# EAGLE board prototype_rev2 (EAGLE 6.3)
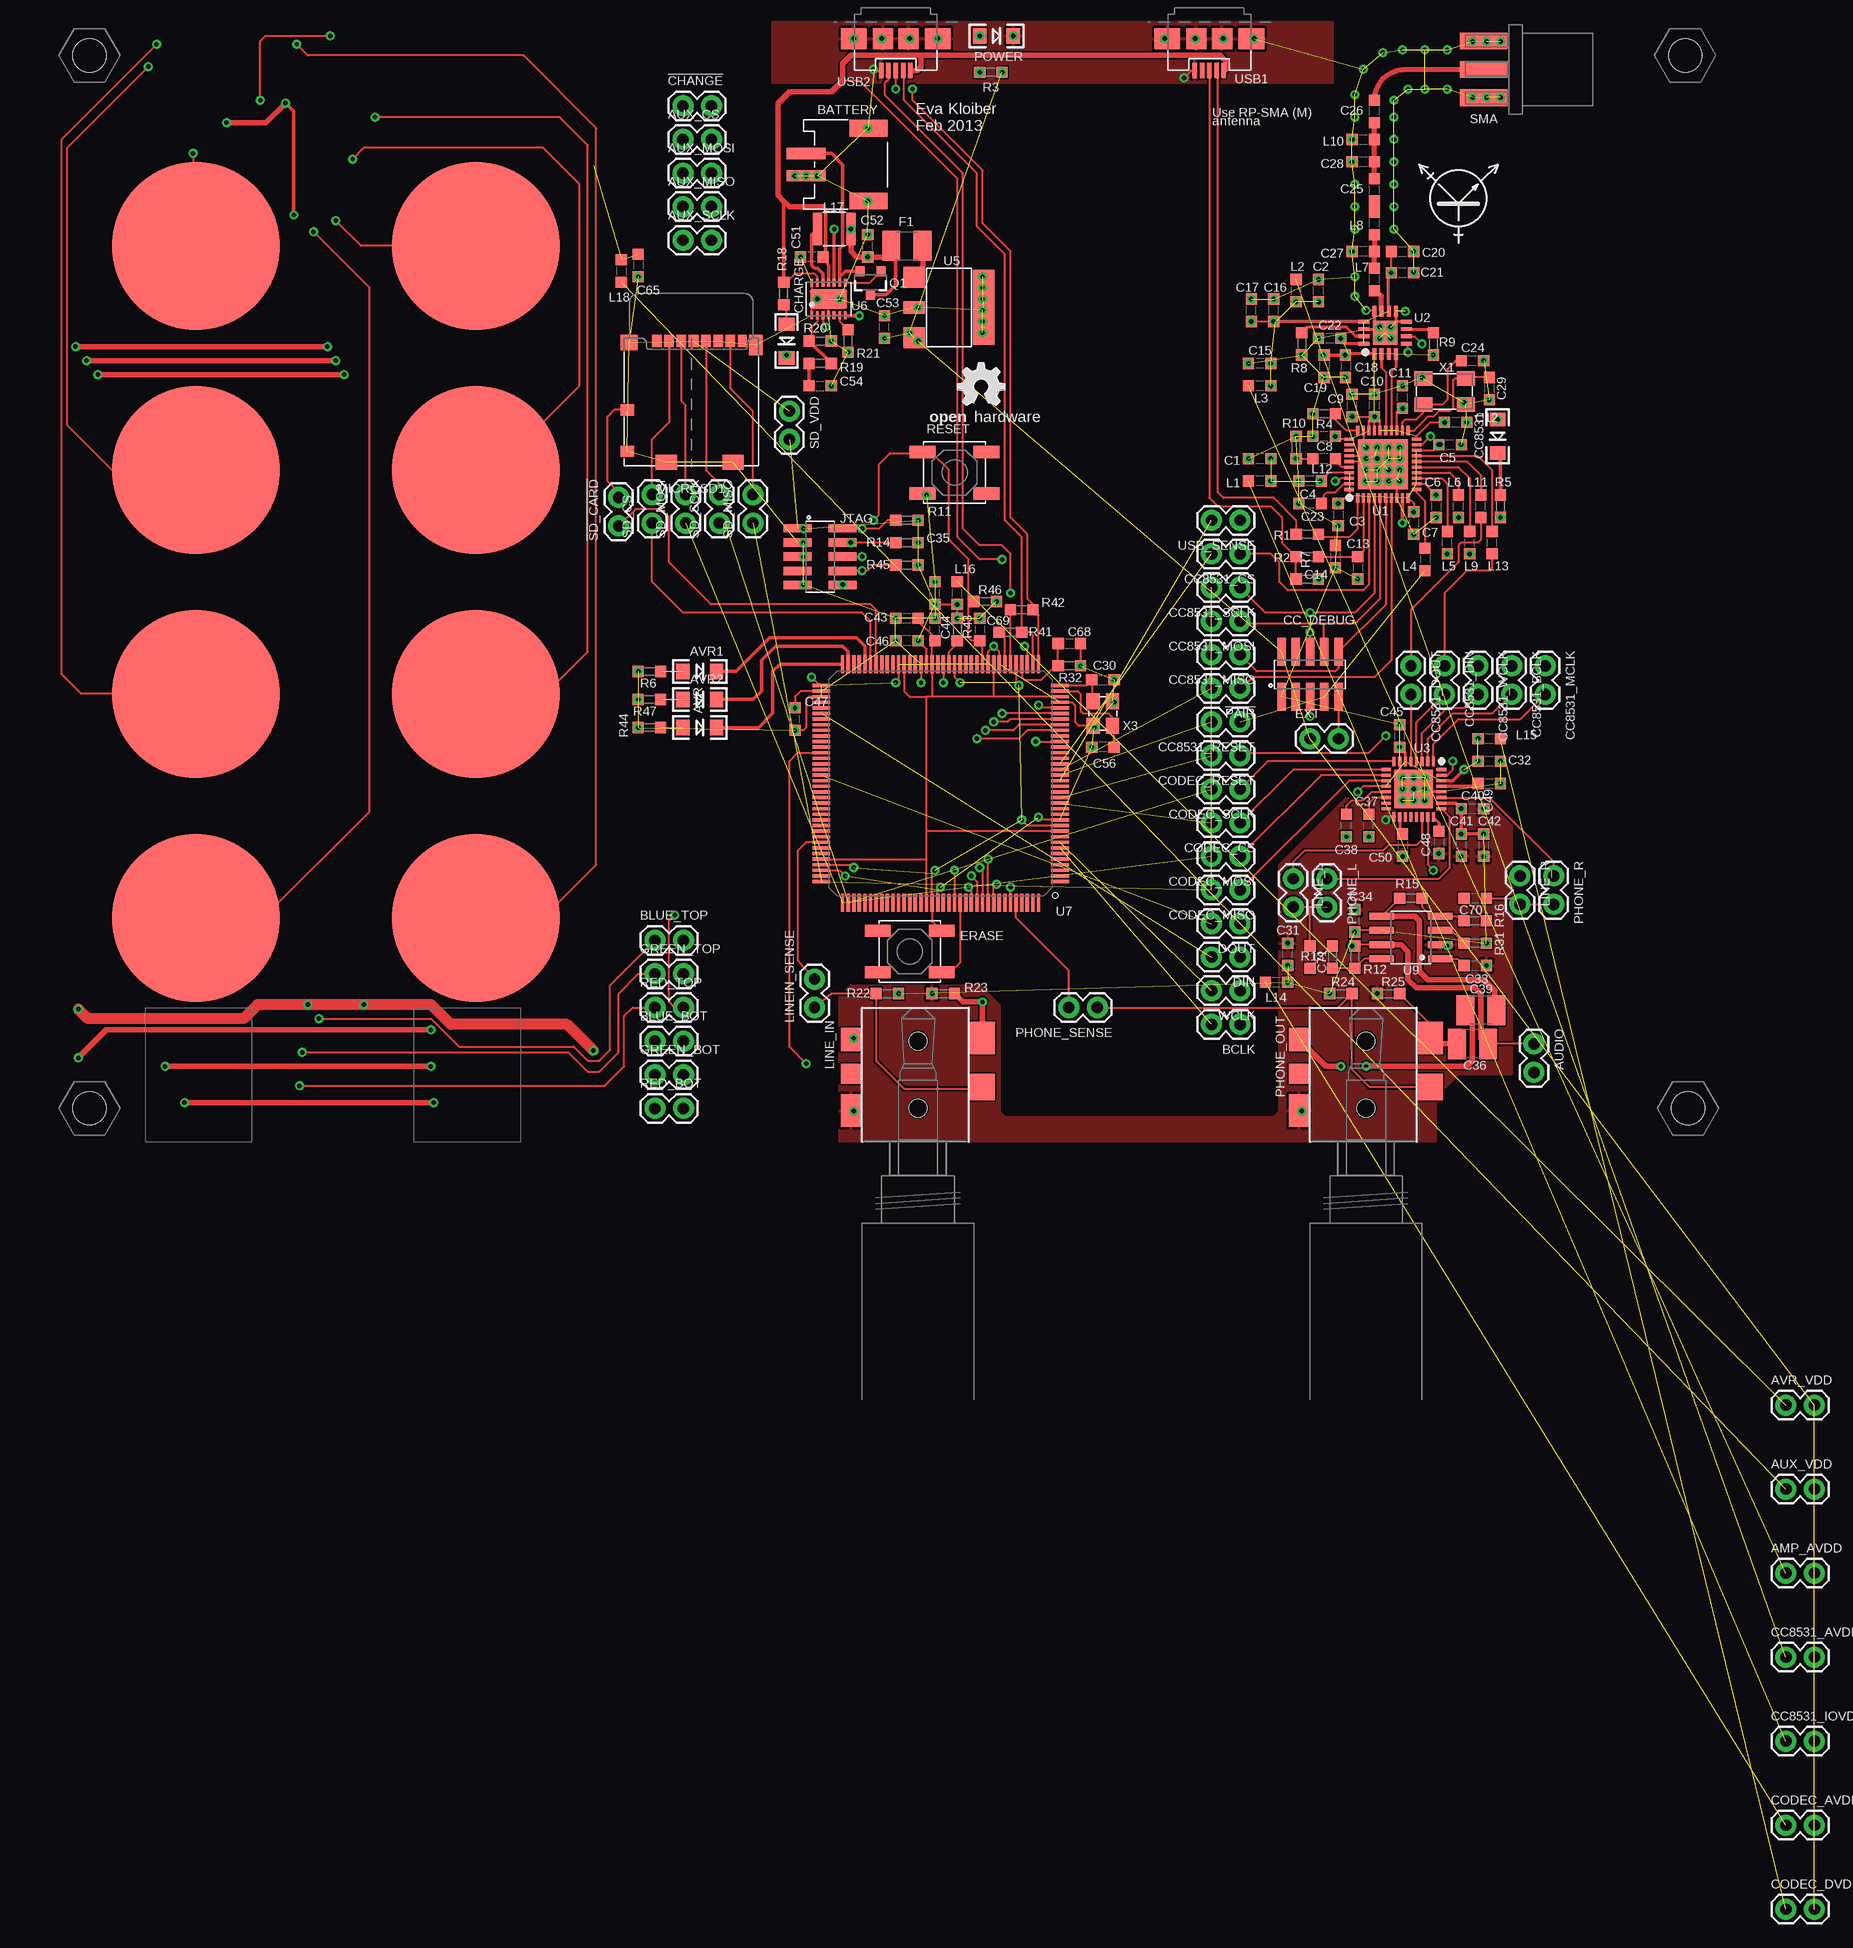
[diagram p3: board, top side]
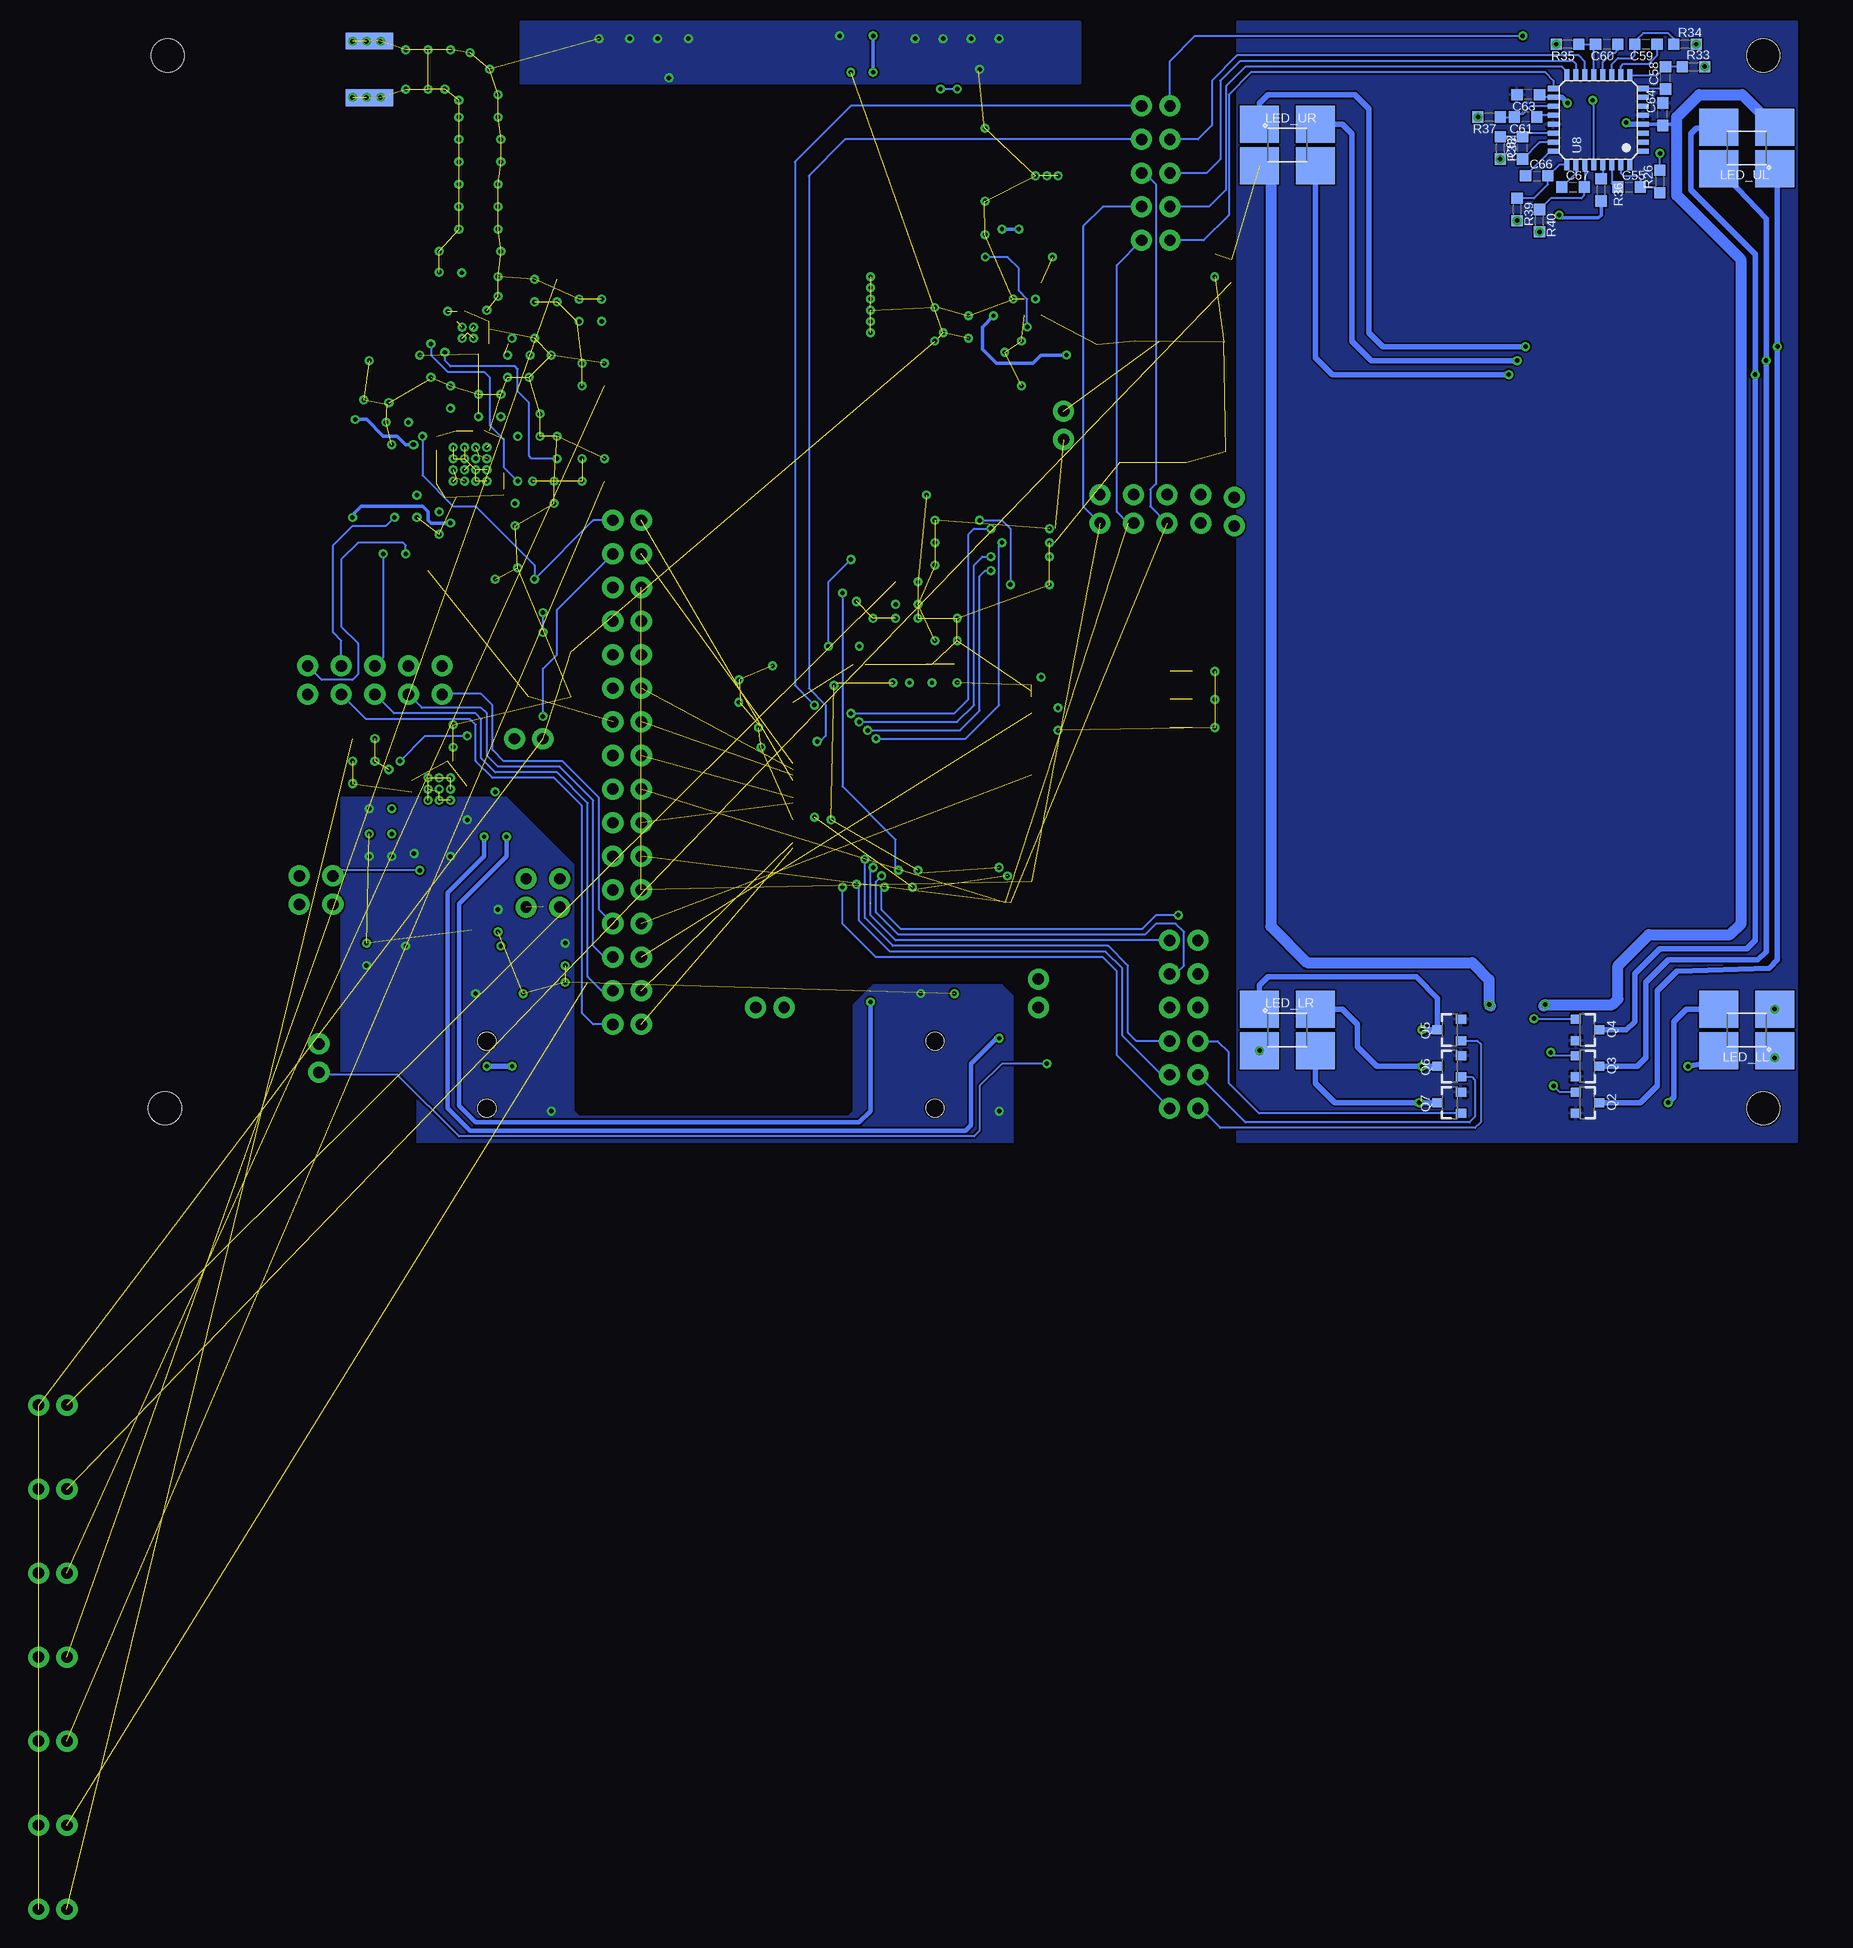
[diagram p4: board, bottom side, seen from below]

No outline drawn. Coordinates in mm, seen from the top.
Copper layers (1+2*3+16): Top 0.034290625mm / dielectric 0.24891875mm / Route2 0.034290625mm / dielectric 39mil / Route3 0.034290625mm / dielectric 0.24891875mm / Bottom 0.034290625mm
Design rules: minimum track width 6mil, minimum drill 15mil, track to track 6mil, track to pad 6mil, pad to pad 6mil, via to via 6mil, smd to smd 0mil, copper to edge 6mil, drill to drill 6mil, minimum pad ring 10mil, minimum via ring 8mil, stop-mask expansion 4mil, vias tented up to drill 0mil, thermal gap 10mil
tRestrict: area 118.8,75 to 119.5,77; area 117.5,74.8 to 118.8,75.5; area 109.2,72.8 to 116.2,73.8; area 115.5,69.8 to 117.8,70.8; area 118,63.5 to 120,70.2; area 116.8,75 to 130,96.8

## Footprints (pad centres in the part's own frame; a part is rotated, then mirrored left to right if it is on the bottom)
1X02 = drill 1.016 pad 1.88: 1 0,0; 2 2.54,0
LED-1206 = smd 1.2 x 1.4: A -1.5,0; C 1.5,0
1775469-2 = smd 1 x 3.5: + -1,-1.75; - 1,-1.75 | smd 1.5 x 3.4: X1 -3.25,3.8; X2 3.25,3.8
C0603 = smd 1 x 1: 1 -1,0; 2 1,0
C1210 = smd 1.6 x 2.7: 1 -1.4,0; 2 1.4,0
HEADER-10P-1.27MM = smd 0.75 x 2.5: 1 -2.54,-2; 2 -2.54,2; 3 -1.27,-2; 4 -1.27,2; 5 0,-2; 6 0,2; 7 1.27,-2; 8 1.27,2; 9 2.54,-2; 10 2.54,2
PTS-525 = smd 2.3 x 1.1: 1 -2.85,1.85; 2 2.85,1.85; 3 -2.85,-1.85; 4 2.85,-1.85
1210 = smd 1.6 x 2.7: 1 -1.4,0; 2 1.4,0
0603 = smd 1 x 1: 1 -1,0; 2 1,0
IFSC-1111AB-01 = smd 0.8 x 2.9: 1 -1.5,0; 2 1.5,0
PLCC-4 = smd 1.5 x 1.1: 1 -1.5,0.75; 2 -1.5,-0.75; 3 1.5,-0.75; 4 1.5,0.75 | smd 3.5 x 3.3: 1-2 -2.5,1.85; 2-2 -2.5,-1.85; 3-2 2.5,-1.85; 4-2 2.5,1.85
STX-35332-5N = smd 1.75 x 2.1: 1 -6,9.15 | smd 1.75 x 1.8: 2 -6,6.1 | smd 2.25 x 2.4: 3 5.75,4.9 | smd 2.25 x 2.9: 4 5.75,9.3 | smd 1.75 x 2.9: 5 -6,2.8 | hole 1.6: 0,9; 0,3
MOLEX_104031-0811 = smd 0.85 x 1.1: CD/DAT3 2.005,0.25; CLK -1.295,0.25; CMD 0.905,0.25; DAT0 -3.495,0.25; DAT2 3.105,0.25; VDD -0.195,0.25; VSS -2.395,0.25 | smd 0.75 x 1.1: DAT1 -4.545,0.25 | smd 1.55 x 1.35: GND1 5.565,0.375 | smd 1.17 x 1.8: GND2 -5.755,0.6 | smd 1.9 x 1.35: GND3 -3.73,11.075; GND4 2.24,11.075 | smd 1.2 x 1: SWA 5.74,6.4; SWB 5.74,10.1
SOT23-3 = smd 0.8 x 0.9: 1 -0.95,-1; 2 0.95,-1; 3 0,1.1
R0603 = smd 1 x 1: 1 -1,0; 2 1,0
CONREVSMA003.062 = smd 4.25 x 1.5 bottom: GND1 2.25,-2.54; GND3 2.25,2.54 | smd 4.25 x 1.5: GND2 2.25,-2.54; GND4 2.25,2.54; SIG 2.25,0
TOUCH-CIRCLE-15MM = smd 15 x 15: P$1 0,0
S-PVQFN-N40 = smd 0.85 x 0.28: 1 -3,2.25; 2 -3,1.75; 3 -3,1.25; 4 -3,0.75; 5 -3,0.25; 6 -3,-0.25; 7 -3,-0.75; 8 -3,-1.25; 9 -3,-1.75; 10 -3,-2.25; 21 3,-2.25; 22 3,-1.75; 23 3,-1.25; 24 3,-0.75; 25 3,-0.25; 26 3,0.25; 27 3,0.75; 28 3,1.25; 29 3,1.75; 30 3,2.25 | smd 0.28 x 0.85: 11 -2.25,-3; 12 -1.75,-3; 13 -1.25,-3; 14 -0.75,-3; 15 -0.25,-3; 16 0.25,-3; 17 0.75,-3; 18 1.25,-3; 19 1.75,-3; 20 2.25,-3; 31 2.25,3; 32 1.75,3; 33 1.25,3; 34 0.75,3; 35 0.25,3; 36 -0.25,3; 37 -0.75,3; 38 -1.25,3; 39 -1.75,3; 40 -2.25,3 | smd 4.5 x 4.5: GND 0,0
S-PVQFN-N16 = smd 1 x 0.35: 1 -1.9,0.975; 2 -1.9,0.325; 3 -1.9,-0.325; 4 -1.9,-0.975; 9 1.9,-0.975; 10 1.9,-0.325; 11 1.9,0.325; 12 1.9,0.975 | smd 0.35 x 1: 5 -0.975,-1.9; 6 -0.325,-1.9; 7 0.325,-1.9; 8 0.975,-1.9; 13 0.975,1.9; 14 0.325,1.9; 15 -0.325,1.9; 16 -0.975,1.9 | smd 2.16 x 2.16: GND 0,0
S-PVQFN-N32 = smd 0.85 x 0.28: 1 -2.475,1.75; 2 -2.475,1.25; 3 -2.475,0.75; 4 -2.475,0.25; 5 -2.475,-0.25; 6 -2.475,-0.75; 7 -2.475,-1.25; 8 -2.475,-1.75; 17 2.475,-1.75; 18 2.475,-1.25; 19 2.475,-0.75; 20 2.475,-0.25; 21 2.475,0.25; 22 2.475,0.75; 23 2.475,1.25; 24 2.475,1.75 | smd 0.28 x 0.85: 9 -1.75,-2.475; 10 -1.25,-2.475; 11 -0.75,-2.475; 12 -0.25,-2.475; 13 0.25,-2.475; 14 0.75,-2.475; 15 1.25,-2.475; 16 1.75,-2.475; 25 1.75,2.475; 26 1.25,2.475; 27 0.75,2.475; 28 0.25,2.475; 29 -0.25,2.475; 30 -0.75,2.475; 31 -1.25,2.475; 32 -1.75,2.475 | smd 3.45 x 3.45: GND 0,0
SOT-223 = smd 1.9 x 1.9: 1 -2.7,-3.1; 3 2.7,-3.1 | smd 1.1 x 1.9: 2 0,-3.1 | smd 6.7 x 1.9: 4 0,3.1
DFN-14 = smd 0.25 x 0.7: 1 -1.5,-1.45; 2 -1,-1.45; 3 -0.5,-1.45; 4 0,-1.45; 5 0.5,-1.45; 6 1,-1.45; 7 1.5,-1.45; 8 1.5,1.45; 9 1,1.45; 10 0.5,1.45; 11 0,1.45; 12 -0.5,1.45; 13 -1,1.45; 14 -1.5,1.45 | smd 3.3 x 1.7: GND 0,0
LQFP-144 = smd 1.6 x 0.3: 1 -10.65,8.75; 2 -10.65,8.25; 3 -10.65,7.75; 4 -10.65,7.25; 5 -10.65,6.75; 6 -10.65,6.25; 7 -10.65,5.75; 8 -10.65,5.25; 9 -10.65,4.75; 10 -10.65,4.25; 11 -10.65,3.75; 12 -10.65,3.25; 13 -10.65,2.75; 14 -10.65,2.25; 15 -10.65,1.75; 16 -10.65,1.25; 17 -10.65,0.75; 18 -10.65,0.25; 19 -10.65,-0.25; 20 -10.65,-0.75; 21 -10.65,-1.25; 22 -10.65,-1.75; 23 -10.65,-2.25; 24 -10.65,-2.75; 25 -10.65,-3.25; 26 -10.65,-3.75; 27 -10.65,-4.25; 28 -10.65,-4.75; 29 -10.65,-5.25; 30 -10.65,-5.75; 31 -10.65,-6.25; 32 -10.65,-6.75; 33 -10.65,-7.25; 34 -10.65,-7.75; 35 -10.65,-8.25; 36 -10.65,-8.75; 73 10.65,-8.75; 74 10.65,-8.25; 75 10.65,-7.75; 76 10.65,-7.25; 77 10.65,-6.75; 78 10.65,-6.25; 79 10.65,-5.75; 80 10.65,-5.25; 81 10.65,-4.75; 82 10.65,-4.25; 83 10.65,-3.75; 84 10.65,-3.25; 85 10.65,-2.75; 86 10.65,-2.25; 87 10.65,-1.75; 88 10.65,-1.25; 89 10.65,-0.75; 90 10.65,-0.25; 91 10.65,0.25; 92 10.65,0.75; 93 10.65,1.25; 94 10.65,1.75; 95 10.65,2.25; 96 10.65,2.75; 97 10.65,3.25; 98 10.65,3.75; 99 10.65,4.25; 100 10.65,4.75; 101 10.65,5.25; 102 10.65,5.75; 103 10.65,6.25; 104 10.65,6.75; 105 10.65,7.25; 106 10.65,7.75; 107 10.65,8.25; 108 10.65,8.75 | smd 0.3 x 1.6: 37 -8.75,-10.65; 38 -8.25,-10.65; 39 -7.75,-10.65; 40 -7.25,-10.65; 41 -6.75,-10.65; 42 -6.25,-10.65; 43 -5.75,-10.65; 44 -5.25,-10.65; 45 -4.75,-10.65; 46 -4.25,-10.65; 47 -3.75,-10.65; 48 -3.25,-10.65; 49 -2.75,-10.65; 50 -2.25,-10.65; 51 -1.75,-10.65; 52 -1.25,-10.65; 53 -0.75,-10.65; 54 -0.25,-10.65; 55 0.25,-10.65; 56 0.75,-10.65; 57 1.25,-10.65; 58 1.75,-10.65; 59 2.25,-10.65; 60 2.75,-10.65; 61 3.25,-10.65; 62 3.75,-10.65; 63 4.25,-10.65; 64 4.75,-10.65; 65 5.25,-10.65; 66 5.75,-10.65; 67 6.25,-10.65; 68 6.75,-10.65; 69 7.25,-10.65; 70 7.75,-10.65; 71 8.25,-10.65; 72 8.75,-10.65; 109 8.75,10.65; 110 8.25,10.65; 111 7.75,10.65; 112 7.25,10.65; 113 6.75,10.65; 114 6.25,10.65; 115 5.75,10.65; 116 5.25,10.65; 117 4.75,10.65; 118 4.25,10.65; 119 3.75,10.65; 120 3.25,10.65; 121 2.75,10.65; 122 2.25,10.65; 123 1.75,10.65; 124 1.25,10.65; 125 0.75,10.65; 126 0.25,10.65; 127 -0.25,10.65; 128 -0.75,10.65; 129 -1.25,10.65; 130 -1.75,10.65; 131 -2.25,10.65; 132 -2.75,10.65; 133 -3.25,10.65; 134 -3.75,10.65; 135 -4.25,10.65; 136 -4.75,10.65; 137 -5.25,10.65; 138 -5.75,10.65; 139 -6.25,10.65; 140 -6.75,10.65; 141 -7.25,10.65; 142 -7.75,10.65; 143 -8.25,10.65; 144 -8.75,10.65
S-PQFP-N32 = smd 0.45 x 1: 1 -2.8,-4; 2 -2,-4; 3 -1.2,-4; 4 -0.4,-4; 5 0.4,-4; 6 1.2,-4; 7 2,-4; 8 2.8,-4; 17 2.8,4; 18 2,4; 19 1.2,4; 20 0.4,4; 21 -0.4,4; 22 -1.2,4; 23 -2,4; 24 -2.8,4 | smd 1 x 0.45: 9 4,-2.8; 10 4,-2; 11 4,-1.2; 12 4,-0.4; 13 4,0.4; 14 4,1.2; 15 4,2; 16 4,2.8; 25 -4,2.8; 26 -4,2; 27 -4,1.2; 28 -4,0.4; 29 -4,-0.4; 30 -4,-1.2; 31 -4,-2; 32 -4,-2.8
SO08 = smd 0.61 x 2.21: 1 -1.905,-2.616; 2 -0.635,-2.616; 3 0.635,-2.616; 4 1.905,-2.616; 5 1.905,2.616; 6 0.635,2.616; 7 -0.635,2.616; 8 -1.905,2.616
STANDOFF_3/16 = hole 2.946: 0,0
USB_MICRO_AB = smd 0.4 x 1.4: 1 -1.3,2.85; 2 -0.65,2.85; 3 0,2.85; 4 0.65,2.85; 5 1.3,2.85 | smd 2.3 x 1.9: GND1 -3.75,0; GND4 3.75,0 | smd 1.8 x 1.9: GND2 -1.15,0; GND3 1.15,0
ABM3C = smd 1.6 x 1.3: 1 -1.9,-1.15; 2 1.9,-1.15; 3 1.9,1.15; 4 -1.9,1.15
ABM8G = smd 1.4 x 1.2: GND-1 -1.1,0.85; GND-2 1.1,-0.85; X1 1.1,0.85; X2 -1.1,-0.85

## Placement (x,y rotation side)
!CHANGE  2P-HEADER-JUMPER  [1X02]  56,92.5 0 top
!PAIR  2P-HEADER-JUMPER  [1X02]  105.75,40.5 180 top
!SD_CARD  2P-HEADER-JUMPER  [1X02]  50.25,55 90 top
AMP_AVDD  2P-HEADER-JUMPER  [1X02]  154.5,-38.5 0 top
AUDIO  2P-HEADER-JUMPER  [1X02]  132,8.75 270 top
AUX_CS  2P-HEADER-JUMPER  [1X02]  56,89.5 0 top
AUX_MISO  2P-HEADER-JUMPER  [1X02]  56,83.5 0 top
AUX_MOSI  2P-HEADER-JUMPER  [1X02]  56,86.5 0 top
AUX_SCLK  2P-HEADER-JUMPER  [1X02]  56,80.5 0 top
AUX_VDD  2P-HEADER-JUMPER  [1X02]  154.5,-31 0 top
AVR  [LED-1206]  57.5,37 0 top
AVR1  [LED-1206]  57.5,42 0 top
AVR2  [LED-1206]  57.5,39.5 0 top
AVR_VDD  2P-HEADER-JUMPER  [1X02]  154.5,-23.5 0 top
BATTERY  BATTERY-LIPO-JST  [1775469-2]  68.75,87.25 270 top
BCLK  2P-HEADER-JUMPER  [1X02]  105.75,10.5 180 top
BLUE_BOT  2P-HEADER-JUMPER  [1X02]  53.5,9 0 top
BLUE_TOP  2P-HEADER-JUMPER  [1X02]  53.5,18 0 top
C1  2.2u  [C0603]  107.5,61 180 top
C2  2.2u  [C0603]  112.75,76 90 top
C3  1u  [C0603]  114.5,56 270 top
C4  100n  [C0603]  112,59 180 top
C5  100n  [C0603]  124.5,62.25 0 top
C6  100n  [C0603]  123.25,56.75 270 top
C7  100n  [C0603]  121.25,55.25 270 top
C8  100n  [C0603]  113.25,63 180 top
C9  100n  [C0603]  115.75,65.75 90 top
C10  220p  [C0603]  117.75,65.75 90 top
C11  100n  [C0603]  120.25,66.5 90 top
C12  100n  [C0603]  125,64.25 0 top
C13  47p  [C0603]  116.25,51.25 270 top
C14  47p  [C0603]  114.25,52.25 270 top
C15  2.2u  [C0603]  107.5,69.5 180 top
C16  10p  [C0603]  108.75,74.25 90 top
C17  1n  [C0603]  106.75,74.25 90 top
C18  10p  [C0603]  115.15,69.25 270 top
C19  1n  [C0603]  113.25,69.25 270 top
C20  1n  [C0603]  120.25,79.5 0 top
C21  18p  [C0603]  120.25,77.6 0 top
C22  1n  [C0603]  113.75,71.75 180 top
C23  1u  [C0603]  112,57 180 top
C24  15p  [C0603]  126.5,69.75 0 top
C25  6.8p_HF  [C0603]  117.75,85 90 top
C26  100p_HF  [C0603]  117.75,92 90 top
C27  1.2p_HF  [C0603]  116.75,79.5 180 top
C28  1.8p_HF  [C0603]  116.75,87.5 180 top
C29  15p  [C0603]  128,67.25 270 top
C30  10p  [C0603]  93.5,41.25 0 top
C31  2.2u  [C0603]  110,16.75 90 top
C32  2.2u  [C0603]  128,34 0 top
C33  1u  [C0603]  126.75,15.75 0 top
C34  100n  [C0603]  116,19.75 90 top
C35  2.2u  [C0603]  78.5,49 90 top
C36  220u  [C1210]  126.5,8.75 180 top
C37  0.47u  [C0603]  117.25,28.25 90 top
C38  0.47u  [C0603]  115.25,28.25 90 top
C39  220u  [C1210]  127.25,11.75 180 top
C40  100n  [C0603]  126.5,29.75 0 top
C41  1u  [C0603]  125.5,26.5 270 top
C42  10u  [C0603]  127.5,26.5 270 top
C43  100n  [C0603]  76,46.75 180 top
C44  4.7u  [C0603]  78.5,45.75 90 top
C45  1u  [C0603]  120,36.25 90 top
C46  10u  [C0603]  76,44.75 180 top
C47  100n  [C0603]  66,37.75 90 top
C48  10u  [C0603]  123.5,26.75 270 top
C49  10u  [C0603]  128,32 0 top
C50  10u  [C0603]  120.25,26.5 270 top
C51  10u  [C0603]  67.5,79 180 top
C52  10u  [C0603]  72.5,80 90 top
C53  10u  [C0603]  74,72.75 90 top
C54  100n  [C0603]  68.25,67.5 0 top
C55  10n  [C0603]  15,85.25 0 bottom
C56  10p  [C0603]  93.5,35.25 180 top
C58  10n  [C0603]  11.75,95 90 bottom
C59  10n  [C0603]  13.5,98 180 bottom
C60  10n  [C0603]  17,98 180 bottom
C61  10n  [C0603]  24.25,91.5 180 bottom
C62  10n  [C0603]  24.5,88.75 90 bottom
C63  100n  [C0603]  24,93.5 180 bottom
C64  100n  [C0603]  12,91.75 90 bottom
C65  2.2u  [C0603]  52,78.25 270 top
C66  10n  [C0603]  23.25,86.25 0 bottom
C67  10n  [C0603]  20,85.25 0 bottom
C68  10p  [C0603]  90.5,44.5 0 top
C69  100n  [C0603]  82.5,45.75 270 top
C70  0.47u  [C0603]  126.75,21.75 180 top
C71  0.47u  [C0603]  112,16.5 270 top
CC8531  [LED-1206]  128.75,63 270 top
CC8531_AVDD  2P-HEADER-JUMPER  [1X02]  154.5,-46 0 top
CC8531_BCLK  2P-HEADER-JUMPER  [1X02]  130,42.5 270 top
CC8531_CS  2P-HEADER-JUMPER  [1X02]  105.75,52.5 180 top
CC8531_DIN  2P-HEADER-JUMPER  [1X02]  124,42.5 270 top
CC8531_DOUT  2P-HEADER-JUMPER  [1X02]  121,42.5 270 top
CC8531_IOVDD  2P-HEADER-JUMPER  [1X02]  154.5,-53.5 0 top
CC8531_MCLK  2P-HEADER-JUMPER  [1X02]  133,42.5 270 top
CC8531_MISO  2P-HEADER-JUMPER  [1X02]  105.75,43.5 180 top
CC8531_MOSI  2P-HEADER-JUMPER  [1X02]  105.75,46.5 180 top
CC8531_RESET  2P-HEADER-JUMPER  [1X02]  105.75,37.5 180 top
CC8531_SCLK  2P-HEADER-JUMPER  [1X02]  105.75,49.5 180 top
CC8531_WCLK  2P-HEADER-JUMPER  [1X02]  127,42.5 270 top
CC_DEBUG  HEADER-10P-SMD-MALE2  [HEADER-10P-1.27MM]  112,41.75 0 top
CHARGE  [LED-1206]  65.25,71.5 270 top
CODEC_AVDD  2P-HEADER-JUMPER  [1X02]  154.5,-61 0 top
CODEC_CS  2P-HEADER-JUMPER  [1X02]  105.75,28.5 180 top
CODEC_DVDD  2P-HEADER-JUMPER  [1X02]  154.5,-68.5 0 top
CODEC_MISO  2P-HEADER-JUMPER  [1X02]  105.75,22.5 180 top
CODEC_MOSI  2P-HEADER-JUMPER  [1X02]  105.75,25.5 180 top
CODEC_RESET  2P-HEADER-JUMPER  [1X02]  105.75,34.5 180 top
CODEC_SCLK  2P-HEADER-JUMPER  [1X02]  105.75,31.5 180 top
DIN  2P-HEADER-JUMPER  [1X02]  105.75,16.5 180 top
DOUT  2P-HEADER-JUMPER  [1X02]  105.75,19.5 180 top
ERASE  TACT_SWITCH-PTS-525  [PTS-525]  76.25,17 180 top
EXT  2P-HEADER-JUMPER  [1X02]  112,36 0 top
F1  2A  [1210]  76,80 0 top
GREEN_BOT  2P-HEADER-JUMPER  [1X02]  53.5,6 0 top
GREEN_TOP  2P-HEADER-JUMPER  [1X02]  53.5,15 0 top
JTAG  HEADER-10P-SMD-MALE2  [HEADER-10P-1.27MM]  68.25,52.25 270 top
L1  BEAD  [0603]  107.5,59 180 top
L2  BEAD  [0603]  110.75,76 90 top
L3  BEAD  [0603]  107.5,67.5 180 top
L4  6.8n  [0603]  122.25,52 270 top
L5  6.8n  [0603]  124.25,53.5 90 top
L6  6.8n  [0603]  125.25,56.75 90 top
L7  2.2n_HF  [0603]  117.75,77 90 top
L8  3.9n_HF  [0603]  117.75,82 90 top
L9  6.8n  [0603]  126.25,53.5 90 top
L10  1.5n_HF  [0603]  116.75,89.5 0 top
L11  6.8n  [0603]  127.25,56.75 90 top
L12  6.8n  [0603]  113.25,61 180 top
L13  6.8n  [0603]  128.25,53.5 90 top
L14  BEAD  [0603]  109,14.25 180 top
L15  BEAD  [0603]  128,36 0 top
L16  BEAD  [0603]  80.5,49 90 top
L17  3.3u  [IFSC-1111AB-01]  69.5,81.5 0 top
L18  BEAD  [0603]  50.5,77.75 270 top
LED_LL  LED_RGB  [PLCC-4]  4.5,10 180 bottom
LED_LR  LED_RGB  [PLCC-4]  45.5,10 0 bottom
LED_UL  LED_RGB  [PLCC-4]  4.5,88.75 180 bottom
LED_UR  LED_RGB  [PLCC-4]  45.5,89 0 bottom
LINE_IN  PHONE_SW-STX-35332-5N  [STX-35332-5N]  77,0 0 top
LINE_L  2P-HEADER-JUMPER  [1X02]  110.5,23.5 270 top
LINE_R  2P-HEADER-JUMPER  [1X02]  130.75,23.75 270 top
LINEIN_SENSE  2P-HEADER-JUMPER  [1X02]  67.75,12 90 top
MICROSD1  MICROSD104031-0811  [MOLEX_104031-0811]  56.75,71.75 180 top
PHONE_L  2P-HEADER-JUMPER  [1X02]  113.5,23.5 270 top
PHONE_OUT  PHONE_SW-STX-35332-5N  [STX-35332-5N]  117,0 0 top
PHONE_R  2P-HEADER-JUMPER  [1X02]  133.75,23.75 270 top
PHONE_SENSE  2P-HEADER-JUMPER  [1X02]  93,12 180 top
POWER  [LED-1206]  84,98.75 0 top
Q1  Si2333  [SOT23-3]  72.75,76.75 180 top
Q2  2N7002  [SOT23-3]  18.75,3.5 270 bottom
Q3  2N7002  [SOT23-3]  18.75,6.75 270 bottom
Q4  2N7002  [SOT23-3]  18.75,10 270 bottom
Q5  2N7002  [SOT23-3]  31,10 90 bottom
Q6  2N7002  [SOT23-3]  31,6.75 90 bottom
Q7  2N7002  [SOT23-3]  31,3.5 90 bottom
R1  33  [R0603]  111.75,54.25 180 top
R2  33  [R0603]  111.75,52.25 180 top
R3  100  [R0603]  83.5,95.5 0 top
R4  56k  [R0603]  113.25,65 0 top
R5  100  [R0603]  129,56.75 90 top
R6  100  [R0603]  53,42 180 top
R7  1.5K  [R0603]  111.75,50.25 180 top
R8  4.3K  [R0603]  111.25,71.25 90 top
R9  4.3K  [R0603]  123,71.25 270 top
R10  10K  [R0603]  110.75,62 270 top
R11  100K  [R0603]  76,55.5 0 top
R12  20K  [R0603]  116,16.5 270 top
R13  20K  [R0603]  114,16.5 90 top
R14  100K  [R0603]  76,53.5 0 top
R15  20K  [R0603]  121,21.75 0 top
R16  20K  [R0603]  126.75,19.75 0 top
R18  330  [R0603]  65,75.75 90 top
R19  8.2  [R0603]  68.25,69.5 0 top
R20  2.94K  [R0603]  68.25,71.5 180 top
R21  1K  [R0603]  70.75,71.5 90 top
R22  1M  [R0603]  74.25,13.25 0 top
R23  100K  [R0603]  79.25,13.25 0 top
R24  1M  [R0603]  114.75,13.25 180 top
R25  100K  [R0603]  119,13.25 0 top
R26  4.7K  [R0603]  12.25,85.75 90 bottom
R31  10K  [R0603]  126.75,17.75 0 top
R32  6.8K  [R0603]  90.5,42.5 180 top
R33  4.7K  [R0603]  9.25,96 0 bottom
R34  4.7K  [R0603]  10,98 0 bottom
R35  4.7K  [R0603]  20.5,98 180 bottom
R36  100K  [R0603]  17.5,85 270 bottom
R37  4.7K  [R0603]  27.5,91.5 180 bottom
R38  4.7K  [R0603]  26.5,88.75 270 bottom
R39  4.7K  [R0603]  25,83.25 270 bottom
R40  4.7K  [R0603]  23,82.25 270 bottom
R41  39  [R0603]  85.25,45.5 0 top
R42  39  [R0603]  86.25,47.5 0 top
R43  100K  [R0603]  80.5,45.75 270 top
R44  100  [R0603]  53,37 180 top
R45  100K  [R0603]  76,51.5 0 top
R46  100K  [R0603]  83,48.25 0 top
R47  100  [R0603]  53,39.5 180 top
RED_BOT  2P-HEADER-JUMPER  [1X02]  53.5,3 0 top
RED_TOP  2P-HEADER-JUMPER  [1X02]  53.5,12 0 top
RESET  TACT_SWITCH-PTS-525  [PTS-525]  80.25,59.75 0 top
SD_CS  2P-HEADER-JUMPER  [1X02]  53.25,55.25 90 top
SD_MISO  2P-HEADER-JUMPER  [1X02]  62.25,55.25 90 top
SD_MOSI  2P-HEADER-JUMPER  [1X02]  56.25,55.25 90 top
SD_SCLK  2P-HEADER-JUMPER  [1X02]  59.25,55.25 90 top
SD_VDD  2P-HEADER-JUMPER  [1X02]  65.5,65.25 270 top
SMA  SMA-REVSMA-0.62  [CONREVSMA003.062]  129.75,95.75 180 top
SW1  TOUCH_PAD-CIRCLE-15MM  [TOUCH-CIRCLE-15MM]  12.5,80 0 top
SW4  TOUCH_PAD-CIRCLE-15MM  [TOUCH-CIRCLE-15MM]  12.5,60 0 top
SW5  TOUCH_PAD-CIRCLE-15MM  [TOUCH-CIRCLE-15MM]  12.5,40 0 top
SW6  TOUCH_PAD-CIRCLE-15MM  [TOUCH-CIRCLE-15MM]  37.5,20 0 top
SW7  TOUCH_PAD-CIRCLE-15MM  [TOUCH-CIRCLE-15MM]  37.5,40 0 top
SW8  TOUCH_PAD-CIRCLE-15MM  [TOUCH-CIRCLE-15MM]  37.5,60 0 top
SW9  TOUCH_PAD-CIRCLE-15MM  [TOUCH-CIRCLE-15MM]  37.5,80 0 top
SW10  TOUCH_PAD-CIRCLE-15MM  [TOUCH-CIRCLE-15MM]  12.5,20 0 top
U1  CC8531  [S-PVQFN-N40]  118.5,60.5 90 top
U2  CC2591  [S-PVQFN-N16]  118.7,72.25 90 top
U3  TLV320AIC3204  [S-PVQFN-N32]  121.25,31.5 270 top
U5  [SOT-223]  79.75,74.5 270 top
U6  LTC4088-2  [DFN-14]  69,75.25 0 top
U7  ATSAM3X8E_ALT-LQFP-144  [LQFP-144]  79,32 180 top
U8  AT42QT1110-TQFP  [S-PQFP-N32]  17.75,91.25 90 bottom
U9  LM4881  [SO08]  121,18.25 90 top
U$1  [STANDOFF_3/16]  145.5,97 90 top
U$2  [PHONE_PLUG]  117,-3 270 top
U$3  [PHONE_PLUG]  77,-3 270 top
U$5  [STANDOFF_3/16]  3,97 270 top
U$8  [STANDOFF_3/16]  145.75,3 90 top
U$9  [TRANS_SILK]  125.25,84.25 0 top
U$10  [OSHW_FILLX150_NOTEXT]  80.5,65.75 0 top
U$12  [STANDOFF_3/16]  3,3 270 top
USB1  USB_MICRO_AB  [USB_MICRO_AB]  103,98.5 180 top
USB2  USB_MICRO_AB  [USB_MICRO_AB]  75,98.5 180 top
USB_SENSE  2P-HEADER-JUMPER  [1X02]  105.75,55.5 180 top
WCLK  2P-HEADER-JUMPER  [1X02]  105.75,13.5 180 top
X1  48MHz  [ABM3C]  124,67 180 top
X3  12MHz  [ABM8G]  93.5,38.25 270 top

## Tracks (layer width: path | path; a pad name or v marks a point on that pad's centre or on a via)
3.3V  (via drill 0.38)  (12 unrouted)
  Top 0.2: U5.3 76.7,71.8 v77,71.5
  other vias: 84.5,95.5 74,71.75 76.25,72.25
!AVR_LED
  Top 0.3: U7.72 64.65,42.65 64,42 64,38.25 62.75,37 59.25,37 59,37.25 AVR.C
!AVR_LED2
  Top 0.3: AVR1.C 60.75,42 63.75,45 71.5,45 72.25,44.25 U7.68
!AVR_LED3
  Top 0.3: AVR2.C 62.25,39.5 63,40.25 63,43 64.25,44.25 70.25,44.25 70.75,43.75 U7.71
!CHANGE  (via drill 0.4)
  Top 0.2: U7.32 88,38.75 v87.75,39
  Bottom 0.2: !CHANGE.2 84.5,92.5 89.5,87.5 89.5,40.75 88,39.25 v87.75,39
!PAIR  (1 unrouted)
!RESET  (via drill 0.4)
  Top 0.2: 77.3,61.5 78.25,61.5 79.75,60 79.75,53.75 81.5,52 81.5,48.25 | U7.47 82.75,44.5 C69.2 81.75,44.75 81.5,45 81.5,48.25 | v73,55.5 73.5,56 73.5,60.5 74.5,61.5 77.3,61.5 | v70.25,49.75 JTAG.10 70.29,49.75 | 77.3,61.5 RESET.1 | R46.1 81.5,48.25
  Bottom 0.2: v73,55.5 71,55.5 70.25,54.75 v70.25,49.75
!SD_CARD
  Top 0.2: U7.66 73.25,47.5 72.75,48 58.5,48 54.75,51.75 54.75,55.75 54,56.5 51.75,56.5 !SD_CARD.1
AGND  (via drill 0.38, 0.4)
  Top 0.2: U3.17 119.03,29.02 v118.75,28.75 | LINE_IN.5 71.2,2.8 v71.25,2.75 | PHONE_OUT.5 111.45,2.8 v111.25,2.75 | U9.2 124.14,17.61 v124.25,17.5
  Top 0.254: U3.17 119.53,29.02
  other vias: 116,20.75 78.25,13.25 118,13.25 127.75,15.75 127.5,29.75 127.5,25.5 125.5,25.5 123.5,25.75 110,17.75 120.25,25.5
  pour Top: 70,0 70,13 71,14 82.5,14 84.25,12.25 84.25,2.75 84.75,2.25 108.75,2.25 109.25,2.75 109.25,24.75 115.25,30.75 118.5,30.75 119.5,29.75 122.75,29.75 123.25,30.25 123.25,30.75 130,30.75 130,6 125.25,6 123.25,4 123.25,0
  pour Bottom: 70,0 70,13 71,14 82.5,14 84.25,12.25 84.25,2.75 84.75,2.25 108.75,2.25 109.25,2.75 109.25,24.75 115.25,30.75 130,30.75 130,6 125.25,6 123.25,4 123.25,0
AUDIO  (via drill 0.4)
  Top 0.2: v67,7 65.5,8.5 65.5,34 66.25,34.75 U7.85
  Bottom 0.2: v67,7 71,7 73,5 73,1 73.5,0.5 119.5,0.5 125,6 131.79,6 AUDIO.2
AUX_!CHANGE  (via drill 0.4)
  Top 0.2: v18.25,93 18.25,98.25 18.75,98.75 v24.5,98.75
  Bottom 0.2: U8.28 18.15,92.9 v18.25,93 | !CHANGE.1 56,96.5 53.75,98.75 v24.5,98.75
AUX_BLUE_BOT
  Bottom 0.2: Q7.1 48.05,2.55 50.75,5.25 50.75,8 51.75,9 BLUE_BOT.1
AUX_BLUE_TOP  (via drill 0.4)
  Top 0.2: v23.5,11 33.5,11 36,8.5 46.25,8.5 47.5,7.25 48.5,7.25 49.5,8.25 49.5,14 BLUE_TOP.1
  Bottom 0.2: Q4.1 23.45,10.95 v23.5,11
AUX_CS
  Bottom 0.2: U8.14 19,94.8 19,96.5 19.5,97 50,97 52.25,94.75 52.25,90.75 53.5,89.5 AUX_CS.1
AUX_GREEN_BOT
  Bottom 0.2: Q6.1 29.05,5.8 28.75,5.5 28.75,2.25 29.25,1.75 49.25,1.75 GREEN_BOT.1
AUX_GREEN_TOP  (via drill 0.4)
  Top 0.2: v22,8 45.75,8 47.5,6.25 48.5,6.25 50.25,8 50.25,13.25 52,15 GREEN_TOP.1
  Bottom 0.2: Q3.1 21.7,7.7 v22,8
AUX_MISO
  Bottom 0.2: U8.16 20.55,95.55 21,96 49.25,96 51,94.25 51,85 52.5,83.5 AUX_MISO.1
AUX_MOSI
  Bottom 0.2: U8.15 19.75,96.25 20,96.5 49.75,96.5 51.5,94.75 51.5,87.75 52.75,86.5 AUX_MOSI.1
AUX_RED_BOT
  Bottom 0.2: Q5.1 28.55,9.05 28.25,8.75 28.25,1.75 28.75,1.25 51.5,1.25 53.25,3 RED_BOT.1
  Bottom 0.5: 29.95,9 Q5.1
AUX_RED_TOP  (via drill 0.4)
  Top 0.2: v21.75,5 49,5 50.75,6.75 50.75,11.25 51.5,12 RED_TOP.1
  Bottom 0.2: Q2.1 21.2,4.45 v21.75,5
AUX_SCLK
  Bottom 0.2: U8.17 21.75,94.75 22.5,95.5 48.75,95.5 50.75,93.5 50.75,82.75 53,80.5 AUX_SCLK.1
AUX_VDD  (via drill 0.38, 0.4)  (2 unrouted)
  Top 0.3: v21.25,82.75 21.25,92 v20.5,92.75
  Top 0.5: v20.5,92.75 18.75,91 v15.25,91
  Top 1: LED_LR.2-2 45.65,10.5 35.25,10.5 33.5,12.25 v27.5,12.25 v22.5,12.25 18,12.25 16.75,11 2.85,11 LED_LL.2-2
  Bottom 0.2: 10.85,90.85 11.9,90.85 C64.1 | U8.18 22.75,93.25 C63.1
  Bottom 0.3: R36.2 17.5,82.75 17.75,82.5 21,82.5 v21.25,82.75 | 10.85,90.85 U8.4
  Bottom 0.5: LED_UR.2-2 48,87.25 LED_UR.2 | LED_LR.2 47,9.15 LED_LR.2-2 | LED_LL.2 3,10.85 LED_LL.2-2 | 2,90.5 LED_UL.2-2 3,89.6 LED_UL.2 | U8.18 21,93.25 v20.5,92.75 | U8.4 15.1,90.85 v15.25,91 | 10.85,90.85 10.75,90.75
  Bottom 1: 22.62,12.12 v22.5,12.25 16.5,12.25 16,12.75 16,15.75 13.25,18.5 6,18.5 5,19.5 5,78.75 10.75,84.5 10.75,90.75 10.75,91.5 8.75,93.5 4.9,93.5 LED_UL.2-2 | LED_LL.2-2 2,11.5 1.75,11.25 | LED_LR.2-2 48.65,8.15 49,8.5 | LED_UR.2 47,19.25 43.75,16 29,16 27.5,14.5 v27.5,12.25 27.38,12.12
  other vias: 2,11.85 48,8.15
AUX_VSS
  pour Bottom: 0,100 50,100 50,0 0,0
AVDD  (via drill 0.4)  (13 unrouted)
  Top 0.2: U1.31 114.35,62.75 C8.1 | U1.20 121.5,63 122.75,64.25 C12.1 124.1,64.25 | U1.23 119.75,65.15 C11.1 | U1.27 117.75,64.65 | 117.75,64.65 C10.1 | U1.28 117.25,64.4 C10.1 | U1.26 118.25,64.4 C10.1 | C10.1 117.75,65 | C9.1 117.65,64.75 117.75,64.65 | C20.1 C21.1 119,77.6 | C17.1 C16.1 | C18.1 115.3,70.25 115.4,70.35
  Top 0.254: U2.1 115.4,70.35 | U2.13 108.92,73.22 C16.1 108.85,73.4 109,73.25 | U2.10 119,74.15 119,77.6 | U2.16 115.08,71.28 C22.1 114.65,71.75
  Top 0.3: C19.1 C18.1
  other vias: 112.75,75 110.75,75 114.25,63 124,64.25 120.25,65.5 115.75,64.75 117.75,64.75 113.15,70.25 108.5,67.5 108.5,69.5 115.15,70.25 108.75,73.25 119.25,77.6 114.75,71.75 106.75,73.25 123,70.25
AVDD_CODEC  (via drill 0.4)  (6 unrouted)
  Top 0.2: U9.6 116.14,18.89 C34.1
  Top 0.3: U3.26 125,30.25 C40.1 C41.1 C42.1
  other vias: 110,14.25 110,15.75 127.5,27.5 125.5,27.5 125.5,29.75 116,18.75 113.75,13.25 127.75,17.75 75.25,13.25
AVR_VDD  (via drill 0.4)  (19 unrouted)
  Top 0.2: U7.57 77.75,44 C46.1 | R43.1 L16.1 C35.1 | U7.73 68.25,40.75 v67.5,41.5 | U7.62 75.25,41.25 v75,41 | U7.52 80.25,41.5 v80.75,41 | U7.41 85.75,41 v86,40.75 | U7.11 86.75,28.25 v86.25,28.75 | v78.5,24.25 78.25,24 U7.125 78.25,19.7 ERASE.3 79,18.75 | U7.105 71,24.75 v71.25,24.5 | U7.75 67.25,39.75 67,39.5 67,37 66.75,36.75 C47.1 | JTAG.1 66.71,54.79 v66.75,54.75
  other vias: 52,37 66,36.75 77,44.75 80.5,46.75 80.5,48 78.5,48 82.5,46.75 84,48.25 77,51.5 77,55.5 77,53.5 52,39.5 52,42
BAT
  Top 0.3: U6.9 70,77.25 | 70,77.25 70.5,77.75 Q1.2 | 70,77.25 70,79.75 70.25,80 70.25,87.25 69.25,88.25 BATTERY.+
BCLK
  Top 0.2: U3.2 122.5,36 124.75,38.25 128.29,38.25 CC8531_BCLK.2
  Bottom 0.2: BCLK.1 107.5,10.5 108.5,11.5 108.5,30 111,32.5 116.5,32.5 118,34 118,37.25 118.5,37.75 127.79,37.75 CC8531_BCLK.2
BLUE_BOT  (via drill 0.4)
  Top 0.2: U7.135 v83.25,25.25
  Bottom 0.2: BLUE_BOT.2 59,9 59.75,9.75 59.75,15.75 61.5,17.5 80.75,17.5 83.25,20 v83.25,25.25
BLUE_TOP  (via drill 0.4)  (1 unrouted)
  Top 0.2: v82.5,24.5 82.75,24.25 82.75,21.25
  Bottom 0.2: BLUE_TOP.2 80.5,18 82.75,20.25 82.75,24.25 v82.5,24.5
C_AUDIO  (via drill 0.38)
  Top 0.2: U9.7 116.11,17.61 R12.1 v115.75,17.5 | AUDIO.1 C36.1
  Top 0.5: 128.25,8.4 C36.1 127.75,8.75 127.25,9.25 127.25,13.25 126.75,13.75 121.5,13.75 120.75,14.5 120.75,17 120.14,17.61 U9.7
C_CS_CODEC
  Top 0.2: U3.9 110.5,33.25 CODEC_CS.1
C_LINEIN_SENSE
  Top 0.2: 82.85,5 LINE_IN.3 82.6,4.75 75.75,4.75 73.25,7.25 R22.1 69.25,13.25 LINEIN_SENSE.1
C_MISO
  Top 0.2: U3.11 115.5,32.25 CODEC_MISO.1
C_MOSI
  Top 0.2: U3.10 113,32.75 CODEC_MOSI.1
C_PHONE_SENSE
  Top 0.2: PHONE_OUT.3 117.35,4.9 115.75,6.5 R24.1 114.5,12 PHONE_SENSE.1
C_RESET_CODEC  (via drill 0.4)
  Top 0.2: U3.31 124.25,32.75 124.75,33.25 v124.75,34 | CODEC_RESET.1 106,34.75 117.25,34.75 v118.75,36.25
  Bottom 0.2: v124.75,34 122.5,36.25 v118.75,36.25
C_SCLK
  Top 0.2: U3.8 108.22,33.98 CODEC_SCLK.1
CS_CC8531  (1 unrouted)
CS_CODEC  (1 unrouted)
CS_SD
  Top 0.2: U7.67 72.75,46.5 72,47.25 56,47.25 53.25,50 SD_CS.1
CS_TOUCH  (via drill 0.4)
  Top 0.2: v87.5,35.75 U7.26
  Bottom 0.2: AUX_CS.2 85,89.5 88.25,86.25 88.25,40.5 86.75,39 86.75,36.25 87.25,35.75 v87.5,35.75
D+_CC8531
  Top 0.2: R7.2 R2.2 109.5,53.5 109.5,55.75 108.5,56.75 103.75,56.75 103,57.5 USB1.3
D+_UC  (via drill 0.38)
  Top 0.2: U7.37 87.75,47 R42.2 87.25,48 86.75,48.5 86.75,54.25 85.25,55.75 85.25,79.5 82.75,82 82.75,86.75 76.5,93 v76.5,94 | USB2.3 v75,94
  Bottom 0.2: v75,94 v76.5,94
D-_CC8531
  Top 0.2: R1.2 110.75,55.5 108.75,57.5 104.25,57.5 103.75,58 103.75,95.55 USB1.2
D-_UC
  Top 0.2: U7.38 87.25,45.25 87,45.5 R41.2 86.25,54 84.75,55.5 84.75,79.25 82.25,81.75 82.25,86.5 75.75,93 75.75,95.55 USB2.2
DIN
  Top 0.2: U3.4 121.5,37.46 CC8531_DIN.2
  Bottom 0.2: DIN.1 106.5,16.5 107.5,17.5 107.5,30.5 110.5,33.5 116,33.5 117,34.5 117,38.25 117.5,38.75 122.79,38.75 CC8531_DIN.2
DOUT
  Top 0.2: CC8531_DOUT.2 U3.5
  Bottom 0.2: DOUT.1 107,20.75 107,30.75 110.25,34 115.5,34 116.5,35 116.5,39 117.5,40 120.96,40 CC8531_DOUT.2
DVDD
  Top 0.3: U3.29 126.75,31.75 C49.1
DVDD_CODEC  (via drill 0.4)  (4 unrouted)
  Top 0.2: U3.12 116.75,31.75 v116.25,31.25
  Top 0.254: U3.6 120.5,34.75 120.25,35 119.75,35 C45.1
  Top 0.3: U3.30 124.75,32.25 v125.75,33.25
  other vias: 127,36 127,34 120,35.25
ERASE
  Top 0.2: U7.130 80.75,16 79.9,15.15 ERASE.1
GND  (via drill 0.38, 0.4)  (143 unrouted)
  Top 0.2: U1.8 119.75,59.25 U1.GND 118.25,60.75 | U1.29 116.75,62.25 v118,61 | U1.34 117.75,61.25 v118,61 | v118,61 118.25,60.75 | U1.35 118.25,60.75 | C21.2 v121.25,77.65 | v117,74.25 117.75,74.25 117.72,74.22 U2.12 | X1.2 122.1,68.1 v122,68.25 | X1.4 v125.75,66 | U6.4 U6.GND v68,75.25 67.75,75.25 | U6.1 67.5,75 67.75,75.25 | U6.14 67.5,75.5 67.75,75.25 | U7.126 78.75,22.5 v79,22.75 | U7.106 70,24.25 v70.5,23.75 | U7.12 88,28.75 v87.75,29 | U7.33 90.75,39.25 91,39 91,37.5 91.35,37.15 X3.GND-2 92.65,37.1 v92.75,37 | U7.44 84.25,43.75 v83.75,44.25 83.25,43.75 U7.46 | U7.58 v77.25,41 | U7.54 v79.25,41 | U7.74 66.5,40.25 66,39.75 C47.2 | v94.5,39.25 94.45,39.25 X3.GND-1 | v82.75,74.25 82.75,74.4 U5.4 | U5.2 v77,74.5 | 121.5,31.25 121.25,31.25 U3.GND | 120,32.75 120.25,32.75 v120.25,32.5 | USB1.GND4 v99,98.5 | USB1.GND3 v101.75,98.5 | USB1.GND2 v104.25,98.5 | USB1.GND1 v107,98.5 | USB1.5 101.4,95.65 v100.75,95 | v127.75,93.25 SMA.GND4 | v127.75,98.25 SMA.GND1 | C68.2 R32.1 | RESET.3 77.35,57.9 v77.75,57.75 | JTAG.5 v66.75,52.25 | JTAG.3 66.73,53.52 v66.75,53.5 | v66.75,49.75 66.29,49.75 JTAG.9
  Top 0.254: U3.28 121.5,31.25 | U3.7 120,32.75 | U2.8 119.67,73.22 | U2.9 119.67,73.22 | 119.67,73.22 U2.GND | U2.12 117.72,73.22 U2.GND | U2.14 118.38,72.58 U2.GND
  Top 0.3: USB2.GND3 v73.75,98.5 | v76.25,98.5 USB2.GND2 | USB2.5 73.1,95.65 v73,95.75 | BATTERY.X1 v72.5,90.5 | 67.75,86.25 v68,86.25 | BATTERY.X2 v72.5,84
  Bottom 0.2: SMA.GND1 v127.75,98.25 | SMA.GND4 v127.75,93.25
  other vias: 120.25,67.5 117.75,66.75 115.75,66.75 113.25,68.25 115.15,68.25 106.5,69.5 112.75,77 110.75,63 106.5,61 111.25,70.25 121.25,79.5 114.5,55 111,57 121.25,54.25 123.25,55.75 125.5,62.25 126,64.25 120,59 119,59 118,59 117,59 117,60 118,60 119,60 120,60 120,61 119,61 117,61 117,62 118,62 119,62 120,62 120.5,74.15 119.2,71.75 118.2,71.75 118.2,72.75 119.2,72.75 115.75,79.5 115.75,87.5 115.75,89.5 112.75,71.75 108.75,75.25 106.75,75.25 112.25,65 112.25,63 111,59 116.25,50.25 114.25,51.25 122.25,30.5 122.25,31.5 122.25,32.5 121.25,32.5 121.25,30.5 120.25,30.5 120.25,31.5 129,32 129,34 120,37.25 119.5,81.5 119.5,83.5 119.5,85.5 119.5,87.5 119.5,89.5 119.5,91.5 116,91.5 116,85.5 116,83.5 116,81.5 116,75.5 116,77.25 69.25,67.5 69.25,71.5 70.75,70.5 119.5,93 116,93.5 122.25,94 124.25,94 122.25,97.5 124.25,97.5 118.5,97.25 116.75,95.75 92.5,35.25 94.5,41.25 66,38.75 78.5,50 75,46.75 78.5,46.75 75,44.75 91.5,42.5 121.25,31.5 128,66.25 127.5,69.75 52,77.25 74,73.75 82.75,77.25 82.75,76.25 82.75,75.25 82.75,73.25 82.75,72.25 85.5,98.75 78.75,98.5 71.25,98.5 67,86.25 66,86.25 72.5,81 70,75.25 66.5,79 129,98.25 126.5,98.25 129,93.25 126.5,93.25 120.25,97.5 120.75,94
  pour Top (rank 2): 64,100 114,100 114,94.5 64,94.5
  pour Bottom: 64,100 114,100 114,94.5 64,94.5
GREEN_BOT  (via drill 0.4)
  Top 0.2: U7.136 83.75,22.75 v84,23
  Bottom 0.2: GREEN_BOT.2 56.75,6 60.25,9.5 60.25,15.5 61.75,17 81,17 83.75,19.75 83.75,22.75 v84,23
GREEN_TOP  (via drill 0.4)
  Top 0.2: v81.75,23.75 82.25,23.25 U7.133
  Bottom 0.2: GREEN_TOP.2 55.5,15 54.75,15.75 54.75,18.75 55.5,19.5 57.25,19.5 58.25,18.5 80.25,18.5 82.25,20.5 82.25,23.25 v81.75,23.75
IN_L  (via drill 0.38)
  Top 0.5: LINE_IN.4 v82.75,12.5 81,12.5 R23.2
  Bottom 0.4: v82.75,12.5 82.75,2.75 83.75,1.75 118,1.75 119.5,3.25 119.5,21.25 115.25,25.5 C38.1
  other vias: 115.25,27.25
IN_R  (via drill 0.38)
  Top 0.5: LINE_IN.1 71.15,9.15 v71.25,9.25
  Bottom 0.4: C37.1 117.25,25.5 120.5,22.25 120.5,3 118.5,1 74.25,1 73.75,1.5 73.75,7 71.5,9.25
  Bottom 0.5: v71.25,9.25 71.5,9.25
  other vias: 117.25,27.25
IOVDD  (via drill 0.38, 0.4)  (6 unrouted)
  Top 0.2: U1.10 121.25,57 C7.1 121.25,55.75 | U1.37 113.6,59.75 C4.1 v112.9,59 | U1.18 123,61.75 123.35,62.1 | 123.35,62.1 C5.1 v123.6,62.25 123.35,62.1 | U1.12 122.25,58.75 C6.1 | U1.40 115.5,57.75 C3.1
  Bottom 0.3: v123.6,62.25 124.25,62.25 125,63 126.25,63 127.75,64.5 CC8531.A
  other vias: 108.5,59 108.5,61 121.25,56.25 114.5,57 123.5,62.25 123.25,57.75 128.75,64.5
IOVDD1
  Top 0.2: U1.1 116.25,54.75 115.5,54 114.25,54 | 114.25,54 113,54 R1.1 | C14.1 114.25,54
IOVDD2
  Top 0.2: R2.1 C13.1 116.75,52.75 U1.2
LINE_L
  Top 0.2: U3.22 122,27 121.5,26.5 119,26.5 118.5,26 111.5,26 110.5,25 LINE_L.1
LINE_R  (via drill 0.4)
  Top 0.2: U3.23 122.5,24.75 v123,24.25
  Bottom 0.2: v123,24.25 130.25,24.25 LINE_R.1
LINEIN_SENSE
  Top 0.2: U7.101 67,26.75 66.25,26 66.25,16.21 LINEIN_SENSE.2
LNA_EN  (via drill 0.4)
  Top 0.2: U2.6 121.33,71.92 v122,71.25 | v114.25,59 114.5,59 114.75,59.25 U1.38
  Bottom 0.2: v122,71.25 122,70.25 120.5,68.75 117.25,68.75 116.75,68.25 116.75,64 115.5,62.75 115.5,60.25 v114.25,59
M_BCLK  (1 unrouted)
M_DIN/S_DOUT  (1 unrouted)
M_DOUT/S_DIN  (1 unrouted)
M_WCLK  (1 unrouted)
MCLK
  Top 0.2: U3.1 123,35.5 125.25,37.75 130.79,37.75 CC8531_MCLK.2
MISO  (3 unrouted)
  Bottom 0.2: AUX_MISO.2 62,83.5 63.75,81.75 63.75,56.75 SD_MISO.1
MOSI  (3 unrouted)
  Bottom 0.2: AUX_MOSI.2 58.25,86.5 57.25,85.5 57.25,58.75 57.75,58.25 57.75,56.75 SD_MOSI.1
N$1
  Top 0.2: U1.21 121.25,63.5 122.5,64.75 123,64.75 123.5,65.25 124.5,65.25 124.75,65.5 124.75,68 124.9,68.15 X1.1 126,68.25 126.15,68.1 126.1,68.1 | C29.1 126.25,68.25 126.1,68.1 | 126.1,68.1 126,68
N$2
  Top 0.2: U1.22 120.25,64.25 120.5,64.5 121.5,64.5 122.1,65.1 X1.3 123.85,65.85 124.25,66.25 124.25,69 125,69.75 C24.1
N$3
  Top 0.2: U1.11 121.5,58 122.25,57.25 L4.1
N$4
  Top 0.2: U1.16 126,60.75 127.25,59.5 L11.2
N$5
  Top 0.2: U1.14 124.5,59.75 125.25,59 L6.2
N$6
  Top 0.2: C56.1 94.5,37 X3.X1 94.25,37.25 94.25,38 94,38.25 91.75,38.25 91.5,38.5 91.5,40 91.25,40.25 U7.35
N$7
  Top 0.254: U2.15 116.08,71.92 115.25,72.75 111.75,72.75 R8.2
N$8
  Top 0.254: U2.7 122.53,72.58 R9.1
N$9
  Top 0.46: C26.2 arc-90 120.5,95.75 SMA.SIG
N$10
  Bottom 0.2: U8.31 15.75,86.5 15.5,86.25 14.25,86.25 14,86 C55.2 12.75,85.25 R26.1
N$11
  Bottom 0.2: C55.1 16.25,85.25 16.55,85.55 U8.30
N$12  (1 unrouted)
N$13
  Top 0.46: U2.11 118.38,75.53 L7.1
N$14
  Top 0.46: L7.2 C27.1 L8.1
N$15
  Top 0.46: L8.2 C25.1
N$16
  Top 0.46: C25.2 C28.1 117.75,89.75 | 117.75,89.75 C26.1 | 117.75,89.75 117.6,89.6 L10.2
N$17
  Top 0.254: U3.24 122.97,29.02 123.5,28.5 C48.1
N$18
  Top 0.2: U1.36 114.85,60.25 114.25,60.85 L12.1
N$19
  Top 0.2: U1.30 115.25,63.5 114.1,64.65 R4.2
N$20
  Top 0.2: R16.2 C70.2
N$21
  Top 0.2: C23.1 113.25,57 113.25,57.75 113.5,58 114.25,58 115,58.75 U1.39
N$22
  Top 0.5: U5.1 77.45,78.2 77.4,79.65 F1.2
N$23
  Top 0.2: U1.13 123.75,59.25 124.25,58.75 L5.2
N$24
  Top 0.2: C71.2 R13.2
N$25
  Top 0.2: U1.15 125.25,60.25 126.25,59.25 L9.2
N$26
  Top 0.2: U9.1 125.16,16.34 C33.1
N$27
  Top 0.2: U1.17 127,61.25 128.25,60 L13.2
N$28  (via drill 0.38)
  Top 0.3: U1.9 v120.25,55.25
  Bottom 0.3: R5.1 129,56 128.25,56.75 122.75,56.75 122.25,56.25 122.25,55.5 122,55.25 v120.25,55.25
  other vias: 129,55.75
N$29
  Top 0.3: R5.2 129,61.5 CC8531.C
N$30
  Bottom 0.2: U8.9 12.5,95.25 C58.2 R33.1
N$31  (via drill 0.4)
  Bottom 0.3: R3.1 POWER.A
  other vias: 82.5,95.5 82.5,98.75
N$32  (via drill 0.38)
  Top 0.3: CHARGE.C v65.25,70.25 | v71.75,73.75 70.55,73.75 U6.7
  Bottom 0.3: v65.25,70.25 67.5,70.25 68.25,69.5 71.5,69.5 72.75,70.75 72.75,72.75 v71.75,73.75
N$33
  Top 0.2: CHARGE.A 65.25,74.5 R18.1
N$34
  Top 0.2: U3.14 117.75,30.75 117.25,30.25 C37.2
N$35
  Top 0.2: C38.2 115.25,30 115.75,30.5 116.75,30.5 117.5,31.25 U3.13
N$36
  Top 0.3: U6.12 68.5,77.5 68,78 67.75,78 67.5,78.25 67.5,81 L17.1
N$37
  Top 0.2: R21.2 70,73.25 U6.6 U6.5
N$38
  Top 0.2: U6.2 68,73.25 67.5,72.75 67.5,71.75 R20.2
  Top 0.3: R20.2 R19.2
N$39
  Top 0.2: MICROSD1.CD/DAT3 54.74,64.25 | SD_CS.2 53.25,62.75 54.74,64.25 | 54.74,64.25 54.75,64.25
N$40
  Top 0.2: U9.5 118.41,20.16 R15.1
  Top 0.5: 118.41,20.16 121.34,20.16 121.75,19.75 121.75,15.25 122.5,14.5 127.5,14.5 128.5,13.5 128.5,10.9 C39.1
N$41
  Bottom 0.2: U8.11 16.55,96.2 16,96.75 14.75,96.75 14.5,97 C59.2 14.25,98.25 14.25,98.5 13.75,99 11.5,99 11,98.5 R34.1
N$42
  Bottom 0.2: U8.13 18.15,97.85 C60.2 R35.1
N$43  (1 unrouted)
  Top 0.2: C71.1 112,21 | PHONE_L.2 LINE_L.2
N$44  (via drill 0.4)
  Top 0.2: v12.25,88.25 12.25,80.25 SW1.P$1
  Bottom 0.2: R26.2 v12.25,88.25
N$45
  Top 0.2: C70.1 130.21,21.75 LINE_R.2 PHONE_R.2
N$46
  Top 0.2: SD_SCLK.2 59.25,58.75 58.05,59.95 MICROSD1.CLK
N$47
  Top 0.2: SD_MOSI.2 56.25,65.75 55.84,66.16 MICROSD1.CMD
N$48
  Top 0.3: R19.1 C54.1
N$49  (via drill 0.38, 0.4)
  Top 0.2: U6.3 68.5,73 v68.75,72.75
  Top 0.3: Q1.3 74.15,75.65 75,76.5 75,78.9 74.8,79.45 F1.1 | U6.10 v69.5,81.5
  Top 0.5: L17.2 71,79.5 71.5,79 C52.1 74.35,79 74.8,79.45
  Bottom 0.2: v68.75,72.75 68.75,75.25 69.5,76 69.5,78 70.5,79 C52.1
  Bottom 0.3: v69.5,81.5 L17.2
  other vias: 72.5,79 71,81.5
N$50
  Top 0.2: CC_DEBUG.9 EXT.2
N$51
  Top 0.2: U6.8 72.65,76.7 Q1.1
N$52
  Top 0.2: SD_MISO.2 62.25,65.25 60.25,67.25 MICROSD1.DAT0
N$53
  Top 0.2: R13.1 R12.2 116.84,16.34 U9.8
N$54
  Top 0.2: R16.1 125.34,20.16 U9.4 123.52,20.25 122.75,20.25 122,21 R15.2
N$55
  Top 0.2: U9.3 124.61,18.89 R31.1
N$56  (via drill 0.4)
  Top 0.5: v24.25,71 v1.75,71
  Bottom 0.5: Q2.3 14,3.5 12.5,5 12.5,13.5 10.75,15.25 2.5,15.5 1.75,16.25 v1.75,71 1.75,86 0.75,85.65 LED_UL.1-2 2,87 LED_UL.1 | LED_UR.1 47,89.85 47.1,89.85 47.1,89.95 LED_UR.1-2 48,92.75 47.25,93.5 39.5,93.5 38.25,92.25 38.25,72.25 37,71 v24.25,71
N$57
  Top 0.2: !SD_CARD.2 50.25,58 49.25,59 49.25,64.75 49.85,65.35 MICROSD1.SWA
N$58  (via drill 0.4)
  Top 0.5: v25,69.75 v2.75,69.75
  Bottom 0.5: Q3.3 14.25,6.75 13.5,7.5 13.5,14.25 11.5,16.25 3.5,16.25 2.75,17 v2.75,69.75 2.75,82.4 LED_UL.4-2 6,87.9 LED_UL.4 | v25,69.75 38,69.75 39.75,71.5 39.75,90 40.6,90.85 LED_UR.4-2 44,89.85 LED_UR.4
N$59
  Top 0.2: X3.X2 92.5,39.5 C30.1 92,40.75 U7.36
N$60
  Bottom 0.2: U8.8 11.8,94.05 C58.1
N$61  (via drill 0.4)
  Top 0.2: SW4.P$1 5,60 1,64 1,88.75 R33.2
  other vias: 8.25,96
N$62
  Bottom 0.2: U8.10 15.75,96 15.5,96.25 13.25,96.25 12.5,97 C59.1
N$63  (via drill 0.4)
  Top 0.2: SW5.P$1 2.25,40 0.5,41.75 0.5,89.5 R34.2
  other vias: 9,98
N$64
  Bottom 0.2: U8.12 17.35,96.4 16.5,97.25 16.25,97.25 16,97.5 C60.1
N$65  (via drill 0.4)
  Top 0.2: SW6.P$1 43.5,20 48.25,24.75 48.25,90.5 41.75,97 22.5,97 R35.2
  other vias: 21.5,98
N$66
  Bottom 0.2: U8.25 21.25,87.25 C66.2 22.25,85.5 23.5,84.25 R39.1
N$67  (1 unrouted)
N$68
  Bottom 0.2: U8.27 18.95,85.3 C67.2 19,84.5 19.25,84.25 22,84.25 R40.1
N$69
  Bottom 0.2: U8.24 22.05,88.45 C66.1
N$70  (via drill 0.4)
  Top 0.2: SW9.P$1 27.25,80 R39.2
  other vias: 25,82.25
N$71
  Bottom 0.2: R37.1 C61.2 25,91.75 24.5,91.75 23.8,92.45 U8.19
N$72  (via drill 0.4)
  Top 0.2: SW7.P$1 43.75,40 47.5,43.75 47.5,89 45,91.5 R37.2
  other vias: 28.5,91.5
N$73
  Bottom 0.2: U8.22 24.2,90.05 C62.2 R38.1
N$74  (via drill 0.4)
  Top 0.2: SW8.P$1 39.25,60 46.75,67.5 46.75,85.5 43.5,88.75 27.5,88.75 R38.2
  other vias: 26.5,87.75
N$75
  Bottom 0.2: U8.23 23,89.25 C62.1
N$76
  Bottom 0.2: U8.20 23.1,91.65 C61.1
N$77
  Bottom 0.2: U8.29 17.35,86.15 R36.1
N$78  (via drill 0.4)
  Top 0.5: v25.75,68.5 v3.75,68.5
  Bottom 0.5: Q4.3 15.25,10 14.5,10.75 14.5,15 12.25,17.25 4.5,17.25 3.75,18 v3.75,68.5 3.75,79.25 9.5,85 9.5,90 9,90.5 7.1,90.5 LED_UL.3-2 6,89.6 LED_UL.3 | LED_UR.3 44,88.15 LED_UR.3-2 43,70 41.5,68.5 v25.75,68.5
N$79  (via drill 0.4)
  Top 0.5: v33.5,10 4.5,10 v2,7.5
  Bottom 0.5: LED_LR.1 47,10.85 LED_LR.1-2 48,14 47.25,14.75 34,14.75 32.1,12.85 Q5.3 v33.5,10 | LED_LL.1 2,8.25 LED_LL.1-2 v2,7.5
N$80  (via drill 0.4)
  Top 0.5: v9.75,6.75 v33.5,6.75
  Bottom 0.5: Q6.3 v33.5,6.75 37.5,6.75 39.25,8.5 39.25,10.5 40.6,11.85 LED_LR.4-2 44,10.85 LED_LR.4 | LED_LL.4 6,9.15 LED_LL.4-2 7,7.25 v9.75,6.75
N$81
  Bottom 0.2: U8.26 19.75,86.5 C67.1
N$82  (via drill 0.4)
  Top 0.2: SW10.P$1 18.5,20 28,29.5 28,76.25 R40.2
  other vias: 23,81.25
N$83  (via drill 0.4)
  Top 0.5: v11.5,3.5 v33.75,3.5
  Bottom 0.5: Q7.3 v33.75,3.5 41.25,3.5 43,5.25 LED_LR.3-2 44,9.15 LED_LR.3 | v11.5,3.5 11,4 11,10.75 9.9,11.85 LED_LL.3-2 6,10.85 LED_LL.3
N$84  (1 unrouted)
N$85
  Top 0.2: U7.43 84.75,45 R41.1
N$86
  Top 0.2: U7.42 R42.1
N$87
  Top 0.2: U7.40 86.25,41.5 86.5,41.25 88,41.25 89,42.25 R32.2 C68.1
N$88  (1 unrouted)
N$89  (1 unrouted)
N$90
  Top 0.2: U7.53 79.75,43.75 80.75,44.75 R43.2
N$91  (1 unrouted)
N$92  (1 unrouted)
N$93  (1 unrouted)
N$94  (1 unrouted)
N$95  (1 unrouted)
N$96  (1 unrouted)
OUT_L
  Top 0.2: PHONE_OUT.4 122.75,10.5 R25.2
  Top 0.5: C36.2 123.8,8.75 PHONE_OUT.4
OUT_R  (via drill 0.38)
  Top 0.5: 125.85,11.15 C39.2 125.85,11.4 126.5,10.75 126.5,7.25 126,6.75 v117,6.75 | v114.75,6.75 113.4,6.75 PHONE_OUT.1
  Bottom 0.5: v117,6.75 v114.75,6.75
PA_EN  (via drill 0.4)
  Top 0.2: v120.75,70.5 120.75,71.12 U2.5 | R10.2 L12.2
  Bottom 0.2: R10.2 113,61 113.25,61.25 113.25,66 114.25,67 114.25,69 114.5,69.25 120.25,69.25 120.75,69.75 v120.75,70.5
  other vias: 110.75,61
PHONE_L
  Top 0.2: U3.25 123.75,29.75 124.5,29 124.5,24.5 123.5,23.5 PHONE_L.1
PHONE_R
  Top 0.2: U3.27 128,30.75 133.75,25 PHONE_R.1
PHONE_SENSE
  Top 0.2: U7.140 85.75,20 90.46,15.29 PHONE_SENSE.2
RED_BOT  (via drill 0.4)
  Top 0.2: U7.139 v85.25,22.75
  Bottom 0.2: RED_BOT.2 56.04,3.04 60.75,7.75 60.75,15.25 62,16.5 82.25,16.5 85.25,19.5 v85.25,22.75
RED_TOP  (via drill 0.4)
  Top 0.2: RED_TOP.2 55.25,12 54.75,12.5 54.75,19.75 v55.25,20.25 | U7.132 81.75,22.5 v81.5,22.75
  Bottom 0.2: v55.25,20.25 57.25,20.25 58.5,19 80,19 81.75,20.75 81.75,22.5 v81.5,22.75
REF
  Top 0.254: U3.18 120,27.75 C50.1
RESET_CC8531  (1 unrouted)
RESET_CODEC  (1 unrouted)
RF_N
  Top 0.2: 118.38,69.12 118.75,68.75 U1.25
  Top 0.254: U2.2 118.38,69.12
RF_P
  Top 0.2: 119.67,69.17 119.25,68.75 U1.24
  Top 0.254: U2.4 119.67,69.17
SCLK  (3 unrouted)
  Bottom 0.2: SD_SCLK.1 59.75,55.25 60.75,56.25 60.75,78.29 AUX_SCLK.2
TCK  (via drill 0.4)
  Top 0.2: U7.28 86.75,36.75 86,36 v82.25,36 | JTAG.4 70.27,53.5 v71,53.5 R14.1
  Bottom 0.2: v82.25,36 74.25,36 71.25,39 71.25,53.25 v71,53.5
TDI  (via drill 0.4)
  Top 0.2: U7.29 86,37.25 85.5,36.75 v83,36.75 | JTAG.8 70.27,51 v72,51 72.5,51 73,51.5 R45.1
  Bottom 0.2: v83,36.75 74.75,36.75 73,38.5 73,50.5 72.5,51 v72,51
TDO  (via drill 0.4)
  Top 0.2: U7.30 85.25,37.75 85,37.5 v83.75,37.5 | v72,52.25 JTAG.6
  Bottom 0.2: v83.75,37.5 75,37.5 73.5,39 73.5,51.5 72.75,52.25 v72,52.25
TMS  (via drill 0.4)
  Top 0.2: U7.31 v84.5,38.25 | JTAG.2 70.29,54.75 v72,54.75 73.5,54.75 74.25,55.5 R11.1
  Bottom 0.2: v84.5,38.25 75.25,38.25 74,39.5 74,54.25 73.5,54.75 v72,54.75
USB_SENSE  (1 unrouted)
USBOTGID  (via drill 0.38)
  Top 0.2: USB2.4 74.35,94.85 74,94.5 74,93.5 81,86.5 81,54.75 82.5,53.25 84.5,53.25 85.25,52.5 v85.25,49 | v80.25,24.25 U7.129
  Bottom 0.2: v85.25,49 85.25,31.75 80.5,27 80.5,24.5 v80.25,24.25
VBUS  (via drill 0.4)
  Top 0.2: U7.39 86.75,44 v86.5,44.25 | 70.25,94.75 71.75,94.75 80.5,86 80.5,54 82.5,52 v84.5,52 | R18.2 65.25,76.75 66,77.5 67.75,77.5 68,77.25 U6.13
  Top 0.3: USB1.1 104.4,95.65 104.5,95.75 | R18.2 65,84 | 68.5,83.5 68.75,83.25 68.75,79 C51.1 69,78.25 U6.11
  Top 0.4: USB2.1 76.35,95.65
  Top 0.5: 76.35,95.65 76.9,95.65 77.25,96 77.25,97 | 68.5,83.5 65.5,83.5 65,84 64.5,84.5 64.5,92.75 65.5,93.75 69.25,93.75 70.25,94.75 70.25,96.25 71,97 77.25,97 | 104.5,95.75 104.5,96.5 104,97 77.25,97
  Bottom 0.2: v86.5,44.25 86.5,50 v84.5,52
VDDCORE
  Top 0.2: 78.25,39.75 U7.56 78.25,44.25 C44.1 78.5,45 77,46.5 C43.1 | U7.124 77.75,25.25 | 77.75,25.25 77.75,27.75 | 77.75,27.75 77.75,39.75 | U7.104 77.75,25.25 | U7.10 77.75,27.75 | U7.34 83.75,39.75 | 83.75,39.75 78.25,39.75 | 78.25,39.75 77.75,39.75 | U7.45 83.75,39.75 | U7.61 75.75,40.25 76.25,39.75 77.75,39.75
WCLK
  Top 0.2: U3.3 122,36.5 124.25,38.75 125.79,38.75 CC8531_WCLK.2
  Bottom 0.2: WCLK.1 106.75,13.5 108,14.75 108,30.25 110.75,33 116.25,33 117.5,34.25 117.5,37.75 118,38.25 125.29,38.25 CC8531_WCLK.2
X_!PAIR
  Top 0.2: U1.7 119.25,43 117.75,41.5 107,41.5 !PAIR.1
X_BCLK  (via drill 0.4)
  Bottom 0.2: L6.1 126,55 129,55 130.75,53.25 130.75,45.5 130,44.75 CC8531_BCLK.1
  other vias: 125.25,55.75
X_CS_CC8531  (via drill 0.4)
  Top 0.2: U1.3 117.25,49.75 116.75,49.25 110,49.25 109.25,50 109.25,51.75 108.5,52.5 CC8531_CS.1 | CC_DEBUG.5 v112,38
  Bottom 0.2: v112,38 112,42.25 110.75,43.5 110.75,47.5 CC8531_CS.1
X_DIN
  Top 0.2: L13.1 128.25,51.25 128,51 126,51 124,49 CC8531_DIN.1
X_DOUT
  Top 0.2: L11.1 127.25,53.75 127,53.5 125.5,53.5 125.25,53.25 125.25,51.75 121,47.5 CC8531_DOUT.1
X_MCLK  (via drill 0.4)
  Bottom 0.2: L5.1 124.25,53.25 124.5,53.5 128.5,53.5 130,52 130,46 128.5,44.5 128.5,41.75 129,41.25 131.75,41.25 CC8531_MCLK.1
  other vias: 124.25,52.5
X_MISO
  Top 0.2: U1.6 118.75,47.96 CC_DEBUG.10 114.54,42.29 114.25,42 107.25,42 CC8531_MISO.1
X_MOSI
  Top 0.2: U1.5 118.25,48.5 116,46.25 113.25,46.25 | 113.25,46.25 106,46.25 CC8531_MOSI.1 | CC_DEBUG.8 113.27,43.98 113.25,44.5 113.25,46.25
X_RESET_CC8531  (2 unrouted)
X_SCLK  (via drill 0.4)
  Top 0.2: U1.4 117.75,49 116,47.25 v112,47.25 108,47.25 CC8531_SCLK.1 | CC_DEBUG.6 v112,45.5
  Bottom 0.2: v112,45.5 v112,47.25
X_USB_SENSE  (via drill 0.4)
  Top 0.2: U1.19 122,62.25 v122.75,63
  Bottom 0.2: v122.75,63 122.75,59.5 120,56.75 118,56.75 112.75,51.5 R7.1 107.5,55.5 USB_SENSE.1
  other vias: 112.75,50.25
X_WCLK  (via drill 0.4)
  Bottom 0.2: L9.1 126.25,43.25 CC8531_WCLK.1
  other vias: 126.25,52.5

## Text on the board
tPlace: Eva Kloiber | Use RP-SMA (M) | antenna | Feb 2013 | open | hardware
tDocu: 2.40mm | AVDD_PA2 | AVDD_LNA | 6.90mm | 1.85mm | AVDD_PA1 | 4-layer 1.6mm | PCB designed for | stackup: FR-4 | with 2 x 2116 | 1oz copper | prepreg and